# EAGLE design IntrusionNode_v2 (EAGLE 7.3.0)
DATABASE: ../../partsdb.txt
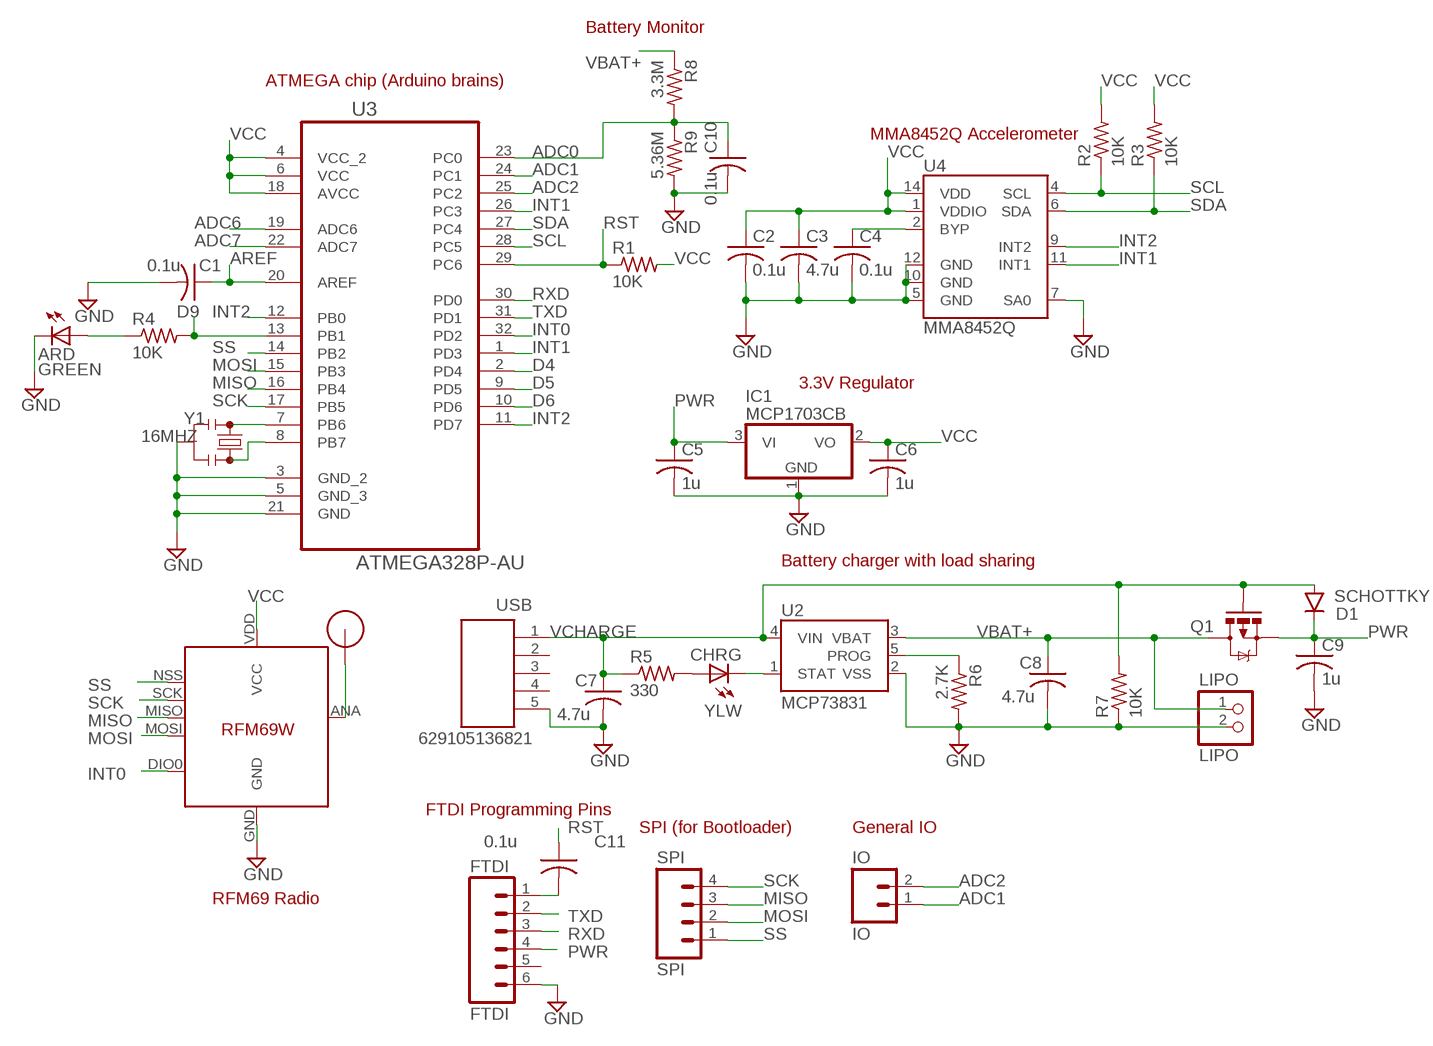
[diagram p0: schematic, sheet 1]

## Parts
ANT  RFM12B_ANTENNA  [RFM12B-ANTENNA]
ARD  GREEN  LEDCHIPLED_0805  [CHIPLED_0805]
C1  0.1u  C-USC0805  [C0805]
C2  0.1u  C-USC0805  [C0805]
C3  4.7u  C-USC0805  [C0805]
C4  0.1u  C-USC0805  [C0805]
C5  1u  C-USC0805  [C0805]
C6  1u  C-USC0805  [C0805]
C7  4.7u  C-USC0805  [C0805]
C8  4.7u  C-USC0805  [C0805]
C9  1u  C-USC0805  [C0805]
C10  0.1u  C-USC0805  [C0805]
C11  0.1u  C-USC0805  [C0805]
CHRG  YLW  LEDCHIPLED_0805  [CHIPLED_0805]
D1  SCHOTTKY  DIODESOD123  [SOD-123]
FTDI  FTDI  M06LOCK_LONGPADS  [1X06_LOCK_LONGPADS]
IC1  MCP1703CB  [SOT23]
IO  IO  M02LOCK_LONGPADS  [1X02_LOCK_LONGPADS]
LIPO  LIPO  JST_2PIN-SMT-RA  [JST-PH-2-SMT-RA]
Q1  MOSFET-PCHANNELSMD  [SOT23-3]
R1  10K  R-US_R0805  [R0805]
R2  10K  R-US_R0805  [R0805]
R3  10K  R-US_R0805  [R0805]
R4  10K  R-US_R0805  [R0805]
R5  330  R-US_R0805  [R0805]
R6  2.7K  R-US_R0805  [R0805]
R7  10K  R-US_R0805  [R0805]
R8  3.3M  R-US_R0805  [R0805]
R9  5.36M  R-US_R0805  [R0805]
SPI  SPI  M04LOCK_LONGPADS  [1X04_LOCK_LONGPADS]
U1  RFM69  [RFM69W-MINPADS]
U2  MCP73831  [SOT23-5]
U3  ATMEGA328P-AU  [QFP80P900X900X120-32N]
U4  MMA8452Q  [QFN-16_0.5MM]
USB  629105136821  [629105136821]
Y1  16MHZ  RESONATOR16MHZ  [RESONATOR-SMD]

## Nets
ADC0: C10.1 R8.2 R9.1 U3.23(PC0)
ADC1: IO.1 U3.24(PC1)
ADC2: IO.2 U3.25(PC2)
ADC6: U3.19(ADC6)
ADC7: U3.22(ADC7)
AREF: C1.1 U3.20(AREF)
D4: U3.2(PD4)
D5: U3.9(PD5)
D6: U3.10(PD6)
D9: R4.2 U3.13(PB1)
GND: ARD.C C1.2 C2.2 C3.2 C4.2 C5.2 C6.2 C7.2 C8.2 C9.2 C10.2 FTDI.6 IC1.1(GND) LIPO.2 R6.2 R7.1 R9.2 U1.GND U2.2(VSS) U3.3(GND_2) U3.5(GND_3) U3.21(GND) U4.5(GND) U4.7(SA0) U4.10(GND) U4.12(GND) USB.5 Y1.2
INT0: U1.DIO0 U3.32(PD2)
INT1: U3.1(PD3) U3.26(PC3) U4.11(INT1)
INT2: U3.11(PD7) U3.12(PB0) U4.9(INT2)
MISO: SPI.3 U1.MISO U3.16(PB4)
MOSI: SPI.2 U1.MOSI U3.15(PB3)
N$1: U3.7(PB6) Y1.1
N$2: U3.8(PB7) Y1.3
N$3: C4.1 U4.2(BYP)
N$4: ANT.P$1 U1.ANA(ANT)
N$5: ARD.A R4.1
N$6: R6.1 U2.5(PROG)
N$7: CHRG.C U2.1(STAT)
N$8: CHRG.A R5.2
N$9: C11.2 FTDI.1
PWR: C5.1 C9.1 D1.C FTDI.4 IC1.3(VI) Q1.2(S)
RST: C11.1 R1.1 U3.29(PC6)
RXD: FTDI.3 U3.30(PD0)
SCK: SPI.4 U1.SCK U3.17(PB5)
SCL: R2.1 U3.28(PC5) U4.4(SCL)
SDA: R3.1 U3.27(PC4) U4.6(SDA)
SS: SPI.1 U1.NSS(SEL) U3.14(PB2)
TXD: FTDI.2 U3.31(PD1)
VBAT+: C8.1 LIPO.1 Q1.3(D) R8.1 U2.3(VBAT)
VCC: C2.1 C3.1 C6.1 IC1.2(VO) R1.2 R2.2 R3.2 U1.VDD(VCC) U3.4(VCC_2) U3.6(VCC) U3.18(AVCC) U4.1(VDDIO) U4.14(VDD)
VCHARGE: C7.1 D1.A Q1.1(G) R5.1 R7.2 U2.4(VIN) USB.1
Unconnected: FTDI.5 USB.2 USB.3 USB.4

## Notes on the sheet
- Battery Monitor
- ATMEGA chip (Arduino brains)
- MMA8452Q Accelerometer
- 3.3V Regulator
- Battery charger with load sharing
- FTDI Programming Pins
- SPI (for Bootloader) | General IO
- RFM69 Radio

## Library data of the parts
ANT = LowPowerLab:RFM12B_ANTENNA; PARTNO: *
ARD = led:LED: LED OSRAM: - CHIPLED LG R971, LG N971, LY N971, LG Q971, LY Q971, LO R971, LY R971 LH N974, LH R974 LS Q976, LO Q976, LY Q976 LO Q996 - Hyper CHIPLED LW Q18S LB Q993, LB Q99A, LB R99A - SideLED LS A670, LO A670, LY A670, LG A670, LP A670 LB A673, LV A673, LT A673, LW A673 LH A674 LY A675 LS A676, LA A676, LO A676, LY A676, LW A676 LS A679, LY A679, LG A679 - Hyper Micro SIDELED® LS Y876, LA Y876, LO Y876, LY Y876 LT Y87S - SmartLED LW L88C, LW L88S LB L89C, LB L89S, LG L890 LS L89K, LO L89K, LY L89K LS L896, LA L896, LO L896, LY L896 - TOPLED LS T670, LO T670, LY T670, LG T670, LP T670 LSG T670, LSP T670, LSY T670, LOP T670, LYG T670 LG T671, LOG T671, LSG T671 LB T673, LV T673, LT T673, LW T673 LH T674 LS T676, LA T676, LO T676, LY T676, LB T676, LH T676, LSB T676, LW T676 LB T67C, LV T67C, LT T67C, LS T67K, LO T67K, LY T67K, LW E67C LS E67B, LA E67B, LO E67B, LY E67B, LB E67C, LV E67C, LT E67C LW T67C LS T679, LY T679, LG T679 LS T770, LO T770, LY T770, LG T770, LP T770 LB T773, LV T773, LT T773, LW T773 LH T774 LS E675, LA E675, LY E675, LS T675 LS T776, LA T776, LO T776, LY T776, LB T776 LHGB T686 LT T68C, LB T68C - Hyper Mini TOPLED® LB M676 - Mini TOPLED Santana® LG M470 LS M47K, LO M47K, LY M47K Source: http://www.osram.convergy.de LUXEON: - LUMILED® LXK2-PW12-R00, LXK2-PW12-S00, LXK2-PW14-U00, LXK2-PW14-V00 LXK2-PM12-R00, LXK2-PM12-S00, LXK2-PM14-U00 LXK2-PE12-Q00, LXK2-PE12-R00, LXK2-PE12-S00, LXK2-PE14-T00, LXK2-PE14-U00 LXK2-PB12-K00, LXK2-PB12-L00, LXK2-PB12-M00, LXK2-PB14-N00, LXK2-PB14-P00, LXK2-PB14-Q00 LXK2-PR12-L00, LXK2-PR12-M00, LXK2-PR14-Q00, LXK2-PR14-R00 LXK2-PD12-Q00, LXK2-PD12-R00, LXK2-PD12-S00 LXK2-PH12-R00, LXK2-PH12-S00 LXK2-PL12-P00, LXK2-PL12-Q00, LXK2-PL12-R00 Source: www.luxeon.com KINGBRIGHT: KA-3528ASYC Source: www.kingbright.com; PARTNO: LG R971-KN-1
C1 C2 C4 C10 C11 = rcl:C-US: CAPACITOR, American symbol; PARTNO: CL21B104KBCNNNC
C3 C7 C8 = rcl:C-US: CAPACITOR, American symbol; PARTNO: CL21A475KPFNNNE
C5 C6 C9 = rcl:C-US: CAPACITOR, American symbol; PARTNO: CL21B105KPFNNNE
CHRG = led:LED: LED OSRAM: - CHIPLED LG R971, LG N971, LY N971, LG Q971, LY Q971, LO R971, LY R971 LH N974, LH R974 LS Q976, LO Q976, LY Q976 LO Q996 - Hyper CHIPLED LW Q18S LB Q993, LB Q99A, LB R99A - SideLED LS A670, LO A670, LY A670, LG A670, LP A670 LB A673, LV A673, LT A673, LW A673 LH A674 LY A675 LS A676, LA A676, LO A676, LY A676, LW A676 LS A679, LY A679, LG A679 - Hyper Micro SIDELED® LS Y876, LA Y876, LO Y876, LY Y876 LT Y87S - SmartLED LW L88C, LW L88S LB L89C, LB L89S, LG L890 LS L89K, LO L89K, LY L89K LS L896, LA L896, LO L896, LY L896 - TOPLED LS T670, LO T670, LY T670, LG T670, LP T670 LSG T670, LSP T670, LSY T670, LOP T670, LYG T670 LG T671, LOG T671, LSG T671 LB T673, LV T673, LT T673, LW T673 LH T674 LS T676, LA T676, LO T676, LY T676, LB T676, LH T676, LSB T676, LW T676 LB T67C, LV T67C, LT T67C, LS T67K, LO T67K, LY T67K, LW E67C LS E67B, LA E67B, LO E67B, LY E67B, LB E67C, LV E67C, LT E67C LW T67C LS T679, LY T679, LG T679 LS T770, LO T770, LY T770, LG T770, LP T770 LB T773, LV T773, LT T773, LW T773 LH T774 LS E675, LA E675, LY E675, LS T675 LS T776, LA T776, LO T776, LY T776, LB T776 LHGB T686 LT T68C, LB T68C - Hyper Mini TOPLED® LB M676 - Mini TOPLED Santana® LG M470 LS M47K, LO M47K, LY M47K Source: http://www.osram.convergy.de LUXEON: - LUMILED® LXK2-PW12-R00, LXK2-PW12-S00, LXK2-PW14-U00, LXK2-PW14-V00 LXK2-PM12-R00, LXK2-PM12-S00, LXK2-PM14-U00 LXK2-PE12-Q00, LXK2-PE12-R00, LXK2-PE12-S00, LXK2-PE14-T00, LXK2-PE14-U00 LXK2-PB12-K00, LXK2-PB12-L00, LXK2-PB12-M00, LXK2-PB14-N00, LXK2-PB14-P00, LXK2-PB14-Q00 LXK2-PR12-L00, LXK2-PR12-M00, LXK2-PR14-Q00, LXK2-PR14-R00 LXK2-PD12-Q00, LXK2-PD12-R00, LXK2-PD12-S00 LXK2-PH12-R00, LXK2-PH12-S00 LXK2-PL12-P00, LXK2-PL12-Q00, LXK2-PL12-R00 Source: www.luxeon.com KINGBRIGHT: KA-3528ASYC Source: www.kingbright.com; PARTNO: LY R976-PS-36
D1 = SparkFun-DiscreteSemi:DIODE: Diode These are standard reverse protection diodes and small signal diodes. SMA package can handle up to about 1A. SOD-323 can handle about 200mA. What the SOD-323 package when ordering, there are some mfgs out there that are 5-pin packages.; PARTNO: B130LAW-7-F
FTDI = SparkFun-Connectors:M06: Header 6 Standard 6-pin 0.1" header. Use with straight break away headers (SKU : PRT-00116), right angle break away headers (PRT-00553), swiss pins (PRT-00743), machine pins (PRT-00117), and female headers (PRT-00115). Molex polarized connector foot print use with SKU : PRT-08094 with associated crimp pins and housings. NOTES ON THE VARIANTS LOCK and LOCK_LONGPADS... This footprint was designed to help hold the alignment of a through-hole component (i.e. 6-pin header) while soldering it into place. You may notice that each hole has been shifted either up or down by 0.005 of an inch from it's more standard position (which is a perfectly straight line). This slight alteration caused the pins (the squares in the middle) to touch the edges of the holes. Because they are alternating, it causes a "brace" to hold the component in place. 0.005 has proven to be the perfect amount of "off-center" position when using our standard breakaway headers. Although looks a little odd when you look at the bare footprint, once you have a header in there, the alteration is very hard to notice. Also,if you push a header all the way into place, it is covered up entirely on the bottom side. This idea of altering the position of holes to aid alignment will be further integrated into the Sparkfun Library for other footprints. It can help hold any component with 3 or more connection pins.; PARTNO: PEC36SAAN
IC1 = linear:MCP1703: 250 mA, 16V, Low Quiescent Current LDO Regulator Source: http://ww1.microchip.com/downloads/en/DeviceDoc/22049b.pdf; PARTNO: MCP1703T-3302E/CB
IO = SparkFun-Connectors:M02: Standard 2-pin 0.1" header. Use with - straight break away headers ( PRT-00116) - right angle break away headers (PRT-00553) - swiss pins (PRT-00743) - machine pins (PRT-00117) - female headers (PRT-00115) Molex polarized connector foot print use with: PRT-08233 with associated crimp pins and housings. 2.54_SCREWTERM for use with PRT-10571. 3.5mm Screw Terminal footprints for PRT-08084 5mm Screw Terminal footprints for use with PRT-08432
LIPO = adafruit:JST_2PIN: JST 2-Pin Connectors of various flavors SMT-RA (S2B-PH-SM4) 4UConnector #17311 SMT (B2B-PH-SM4) THM-RA (S2B-PH) THM (B2B-PH); PARTNO: S2B-PH-SM4-TB(LF)(SN)
Q1 = SparkFun-DiscreteSemi:MOSFET-PCHANNEL: Generic PMOSFET IRLML2244 - TRANS-11153 (SOT-23 -20V -4.3A) (1.Gate 2.Source 3.Drain) FQP27P06 - COM-10349 <http://www.sparkfun.com/products/10349> (TO-220 -60V -27A) (1.Gate 2.Source 3.Drain); PARTNO: SSM3J328R,LF
R1-R4 R7 = rcl:R-US_: RESISTOR, American symbol; PARTNO: RC2012J103CS
R5 = rcl:R-US_: RESISTOR, American symbol; PARTNO: RC2012J331CS
R6 = rcl:R-US_: RESISTOR, American symbol; PARTNO: RC2012J272CS
R8 = rcl:R-US_: RESISTOR, American symbol; PARTNO: RC2012F335CS
R9 = rcl:R-US_: RESISTOR, American symbol; PARTNO: RC2012F5364CS
SPI = SparkFun-Connectors:M04: Header 4 Standard 4-pin 0.1" header. Use with straight break away headers (SKU : PRT-00116), right angle break away headers (PRT-00553), swiss pins (PRT-00743), machine pins (PRT-00117), and female headers (PRT-00115). Molex polarized connector foot print use with SKU : PRT-08231 with associated crimp pins and housings. 1MM SMD Version SKU: PRT-10208; PARTNO: PEC36SAAN
U1 = LowPowerLab:RFM69; PARTNO: RFM69W
U2 = SparkFun-PowerIC:MCP73831: Miniature single cell, fully integrated Li-Ion, Li-polymer charge management controller http://ww1.microchip.com/downloads/en/DeviceDoc/20001984g.pdf IC-09995; PARTNO: MCP73831T-2ATI/OT; PROD_ID: IC-09995
U3 = MTRTech:ATMEGA328P-AU: 8-bit Microcontroller with In-System Programmable Flash; MPN: ATMEGA328P-AU; OC_FARNELL: 1715486; OC_NEWARK: 14R4631; PACKAGE: TQFP-32; PARTNO: ATMEGA328P-AUR; SUPPLIER: Atmel
U4 = SparkFun-Sensors:MMA8452Q: MMA8452Q 3-Axis, 12/8-bit Digital Accelerometer Supply Voltage: 1.6-3.6V Range: +/- 2g, 4g, 8g Interface: I2C, 12-bit and 8-bit ODR: 1.56 Hz - 800 Hz Package: QFN-16 http://cache.freescale.com/files/sensors/doc/data_sheet/MMA8452Q.pdf; PARTNO: MMA8452QT; PROD_ID: IC-10769
USB = Wurth_Elektronik_Electromechanic_Input-Output_Connectors_rev15c:629105136821: WR-COM SMT Horizontal 5 Contacts Micro USB Type B,5 pins=>Code : Con_I-O_COM_MicroUSB_629105136821 <http://katalog.we-online.de/media/images/eican/Con_I-O_COM_MicroUSB_629105136821_pf2.jpg> Details see: http://katalog.we-online.de/en/em/629_105_136_821 Created 2014-07-09, Karrer Zheng 2014 (C) Würth Elektronik; PARTNO: 629105136821
Y1 = SparkFun-FreqCtrl:RESONATOR: Resonator Small SMD resonator. Used, eg, on the Arduino Pro/ Pro Mini boards. 8MHz- XTAL-08895 16MHz- XTAL-08900; PARTNO: CSTCE16M0V53-R0; PROD_ID: XTAL-08900

## Net classes
1 power: width 0.381 mm, clearance 0.254 mm

## Board
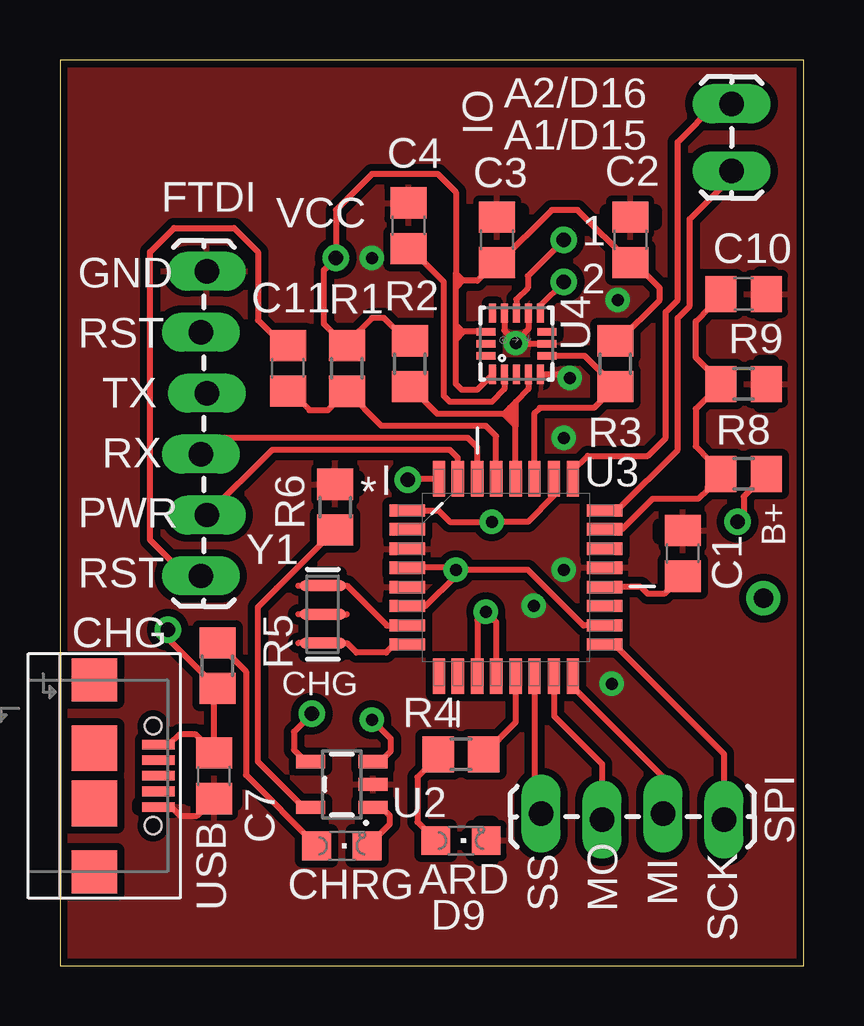
[diagram p1: board, top side]
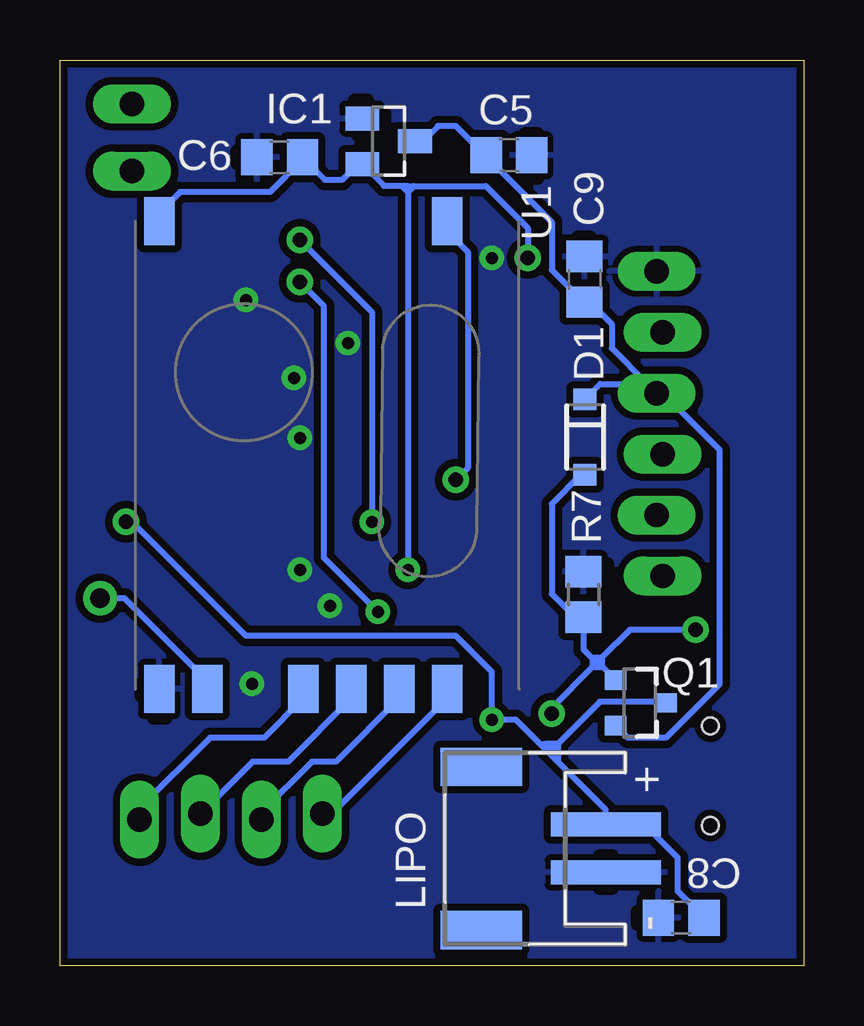
[diagram p2: board, bottom side, seen from below]

Size 31 x 37.75 mm. Coordinates in mm from the lower left corner, seen from the top.
Outline: 0,37.75 0,0 31,0 31,37.75 0,37.75
Copper layers (1*16): Top 0.035mm / dielectric 1.5mm / Bottom 0.035mm
Design rules "SparkFun-2-layer": minimum track width 7mil, minimum drill 15mil, track to track 8mil, track to pad 8mil, pad to pad 8mil, via to via 8mil, smd to smd 8mil, copper to edge 8mil, drill to drill 8mil, minimum pad ring 12mil, minimum via ring 10mil, stop-mask expansion 4mil, vias tented up to drill 20mil, thermal gap 10mil
tRestrict: area 29.2,28.8 to 29.7,28.9; area 29.2,27.1 to 29.7,27.2; area 29.2,25.1 to 29.7,25.1; area 29.2,23.4 to 29.7,23.4; area 25,17.9 to 25.2,18.4; area 17.5,5.8 to 18,6; area 17.5,4.5 to 18,4.5; area 7.2,6.8 to 7.3,7.2; area 12.3,19.9 to 12.4,20.4; area 15.3,31.5 to 15.4,32; area 19,31 to 19.2,31.5; area 22.8,31 to 23,31.5; 5 more areas
bRestrict: area 6.7,1.8 to 6.9,2.2; area 27.5,11.2 to 27.6,11.8; area 23.5,33.5 to 23.6,34; area 18.2,35.9 to 18.7,36; area 17.5,35 to 17.7,35.5; area 11.1,32.9 to 11.6,33; area 11.1,34.5 to 11.6,34.6; area 8.9,30.2 to 9.4,30.4; area 8.2,16.1 to 8.4,16.8; area 8,4.5 to 8.5,4.5; area 8,3.2 to 8.5,3.3; area 18.2,34.7 to 18.6,34.8; 1 more areas

### Footprints (pad centres in the part's own frame; a part is rotated, then mirrored left to right if it is on the bottom)
RFM12B-ANTENNA = drill 0.8 pad 1.422: P$1 0,0
CHIPLED_0805 = smd 1.2 x 1.2: A 0,-1.05; C 0,1.05
C0805 = smd 1.3 x 1.5: 1 -0.95,0; 2 0.95,0
SOD-123 = smd 0.9 x 0.95: A 1.575,0; C -1.575,0
1X06_LOCK_LONGPADS = drill 1.016 long: 1 0,0; 2 2.54,-0.254; 3 5.08,0; 4 7.62,-0.254; 5 10.16,0; 6 12.7,-0.254
SOT23 = smd 1 x 1.4: 1 -0.95,-1.1; 2 0.95,-1.1; 3 0,1.1
1X02_LOCK_LONGPADS = drill 1.016 long: 1 -0.127,0; 2 2.667,0
JST-PH-2-SMT-RA = smd 1 x 4.6: 1 1,-3.7; 2 -1,-3.7 | smd 1.6 x 3.4: NC1 -3.4,1.5; NC2 3.4,1.5
SOT23-3 = smd 0.8 x 0.9: 1 -0.95,-1; 2 0.95,-1; 3 0,1.1
R0805 = smd 1.3 x 1.5: 1 -0.95,0; 2 0.95,0
1X04_LOCK_LONGPADS = drill 1.016 long: 1 0,0; 2 2.54,-0.254; 3 5.08,0; 4 7.62,-0.254
RFM69W-MINPADS = smd 2 x 1.27: ANA 8,-5; DIO0 -11.5,5; GND 8,-7; MISO 8,1; MOSI 8,3; NSS 8,5; SCK 8,-1; VDD -11.5,-7
SOT23-5 = smd 0.55 x 1.2: 1 -0.95,-1.3; 2 0,-1.3; 3 0.95,-1.3; 4 0.95,1.3; 5 -0.95,1.3
QFP80P900X900X120-32N = smd 1.473 x 0.508: 1 -4.115,2.794; 2 -4.115,2.007; 3 -4.115,1.194; 4 -4.115,0.406; 5 -4.115,-0.406; 6 -4.115,-1.194; 7 -4.115,-2.007; 8 -4.115,-2.794; 17 4.115,-2.794; 18 4.115,-2.007; 19 4.115,-1.194; 20 4.115,-0.406; 21 4.115,0.406; 22 4.115,1.194; 23 4.115,2.007; 24 4.115,2.794 | smd 0.508 x 1.473: 9 -2.794,-4.115; 10 -2.007,-4.115; 11 -1.194,-4.115; 12 -0.406,-4.115; 13 0.406,-4.115; 14 1.194,-4.115; 15 2.007,-4.115; 16 2.794,-4.115; 25 2.794,4.115; 26 2.007,4.115; 27 1.194,4.115; 28 0.406,4.115; 29 -0.406,4.115; 30 -1.194,4.115; 31 -2.007,4.115; 32 -2.794,4.115
QFN-16_0.5MM = smd 0.8 x 0.3: 1 -1.275,1; 2 -1.275,0.5; 3 -1.275,0; 4 -1.275,-0.5; 5 -1.275,-1; 9 1.275,-1; 10 1.275,-0.5; 11 1.275,0; 12 1.275,0.5; 13 1.275,1 | smd 0.3 x 0.8: 6 -0.5,-1.275; 7 0,-1.275; 8 0.5,-1.275; 14 0.5,1.275; 15 0,1.275; 16 -0.5,1.275
629105136821 = smd 0.4 x 1.35: 1 -1.3,0; 2 -0.65,0; 3 0,0; 4 0.65,0; 5 1.3,0 | smd 1.8 x 1.9: Z1 -4,-2.675; Z4 4,-2.675 | smd 1.9 x 1.9: Z2 -1.15,-2.675; Z3 1.15,-2.675 | hole 0.7: -2.075,-0.225; 2.075,-0.225
RESONATOR-SMD = smd 0.45 x 1.905: 1 -1.2,0; 2 0,0; 3 1.2,0

### Placement (x,y rotation side)
ANT  29.33,15.31 0 top
ARD  16.72,5.21 270 top
C1  25.96,17.18 90 top
C2  23.78,30.25 90 top
C3  18.22,30.25 90 top
C4  14.53,30.84 90 top
C5  12.28,33.78 0 bottom
C6  21.84,33.69 180 bottom
C7  6.42,7.91 270 top
C8  5.1,2 180 bottom
C9  9.13,28.61 90 bottom
C10  28.5,28 0 top
C11  9.5,24.9 90 top
CHRG  11.75,4.99 270 top
D1  9.11,22.03 270 bottom
FTDI  5.87,16.24 90 top
IC1  17.3,34.36 270 bottom
IO  28,33.25 90 top
LIPO  11.94,4.88 90 bottom
Q1  6.83,10.95 270 bottom
R1  11.96,24.89 90 top
R2  14.59,25.09 90 top
R3  23.15,25.09 90 top
R4  16.72,8.81 0 top
R5  6.57,12.5 90 top
R6  11.47,19.11 90 top
R7  9.17,15.47 270 bottom
R8  28.5,20.5 180 top
R9  28.5,24.25 0 top
SPI  20.06,6.33 0 top
U1  19.86,19.53 270 bottom
U2  11.75,7.55 90 top
U3  18.59,16.18 0 top
U4  19.03,25.92 90 top
USB  4.11,7.91 270 top
Y1  10.95,14.64 270 top

### Tracks (layer width: path | path; a pad name or v marks a point on that pad's centre or on a via)
ADC0
  Top 0.254: R8.2 27.5,20.5 | C10.1 27.1,27.55 27.1,27.45 26.5,26.85 26.5,25.35 27.55,24.3 R9.1 26.5,23.2 26.5,21.65 27.1,21.05 27.1,20.95 R8.2 | U3.23 23.44,18.19 24.7,19.45 26.6,19.45 27,19.85 27,19.95 R8.2
ADC1
  Top 0.254: U3.24 23.22,18.97 25.75,21.5 25.75,27 26.25,27.5 26.25,31.12 28,32.87 IO.1
ADC2
  Top 0.254: U3.25 21.38,20.63 22,21.25 24.5,21.25 25.25,22 25.25,27.25 25.75,27.75 25.75,34.33 27.33,35.92 IO.2
AREF
  Top 0.254: C1.1 25.94,16.25 25.19,15.5 24.5,15.5 24.23,15.77 U3.20
D9
  Top 0.254: U3.13 19,10.14 R4.2
GND  (via drill 0.5)
  Top 0.254: U4.12 18.53,26.47 18.88,26.12 | 18.88,26.12 19.08,25.92 U4.7 | U4.10 19.53,26.53 19.25,26.25 | 19.25,26.25 19.12,26.12 18.88,26.12 | 19.25,26 19.25,26.25 | v21.25,24.5 21.11,24.64 U4.5 | 6.07,6.61 5.96,6.61 | USB.5 4.17,6.55 4.7,6.55 5,6.25 5.71,6.25 C7.2
  Top 0.406: 6.07,6.61 C7.2
  other vias: 19.75,15 13,29.5 23.25,27.75 21,22 23,11.75 19,25.95 21,16.5
  pour Bottom (isolate 0.305): -1.5,38.75 -1.5,-1.5 32.5,-1.5 32.5,38.75
  pour Top (isolate 0.305): -2.25,40 -2.25,-1.25 32.5,-1.25 32.5,40
INT0  (via drill 0.6)
  Top 0.254: v14.5,20.25 14.54,20.3 U3.32
  Bottom 0.254: U1.DIO0 14.86,30.61 14,29.75 14,20.75 v14.5,20.25
INT1  (via drill 0.5, 0.6)
  Top 0.254: v21,30.25 19.5,28.75 19.5,28.25 19.03,27.78 U4.11 | U3.1 15.78,18.97 16.25,18.5 v18,18.5 19.5,18.5 20.6,19.6 U3.26
  Bottom 0.254: v21,30.25 18,27.25 v18,18.5
INT2  (via drill 0.5, 0.6)
  Top 0.254: v21,28.5 20.03,27.53 U4.9 | U3.11 17.4,14.4 v17.75,14.75 18.18,14.32 U3.12
  Bottom 0.254: v17.75,14.75 20,17 20,27.5 v21,28.5
MISO
  Top 0.254: U3.16 21.38,11.62 25.14,7.86 SPI.3
  Bottom 0.254: U1.MISO 18.86,11.14 21.5,8.5 22.97,8.5 SPI.3
MOSI
  Top 0.254: U3.15 20.6,10.4 22.6,8.4 SPI.2
  Bottom 0.254: U1.MOSI 16.86,11.14 19.5,8.5 20.5,8.5 22.6,6.4 SPI.2
N$1
  Top 0.254: 11.97,15.84 13.63,14.17 U3.7
N$2
  Top 0.254: U3.8 13.94,13.39 13.6,13.05 12.36,13.05 11.97,13.44
N$3
  Top 0.254: U4.2 18.53,24.03 18,23.5 16.25,23.5 16,23.75 16,28.5 14.61,29.89 C4.1
N$4
  Bottom 0.254: ANT.P$1 28.31,15.31 24.86,11.86 U1.ANA
N$5
  Top 0.254: 15.77,5.31 ARD.A 14.9,5.98 14.9,7.85 15.77,8.72 R4.1
N$6
  Top 0.254: R6.1 9.03,15.72 8.5,15.19 8.25,14.94 8.25,8.5 10.15,6.6 U2.5
N$7
  Top 0.254: CHRG.C 12.84,4.99 13.75,5.9 13.75,6.25 13.4,6.6 U2.1
N$8
  Top 0.254: R5.2 7.75,12.27 7.75,7.94 CHRG.A
N$9
  Top 0.254: FTDI.1 5.26,16.24 3.75,17.75 3.75,29.75 4.75,30.75 7.25,30.75 8.25,29.75 8.25,26.9 9,26.15 9.2,26.15 C11.2
PWR
  Bottom 0.254: 6.51,24.24 8,25.74 8,26.75 8.91,27.66 C9.1 9.16,27.66 10.5,29 10.5,31 13.23,33.73 C5.1 13.28,33.78 14.5,35 15.25,35 15.89,34.36 IC1.3 | 6.51,24.24 FTDI.4 5.86,23.86 3.5,21.5 3.5,11.75 5.75,9.5 7.33,9.5 Q1.2 | D1.C 8.47,24.24 6.51,24.24
RST
  Top 0.254: U3.29 18.18,22.07 17.75,22.5 13.4,22.5 R1.1 11.17,23.15 10.4,23.15 9.6,23.95 C11.1
RXD
  Top 0.254: U3.30 17.4,21.6 17,22 6.55,22 FTDI.3
SCK
  Top 0.254: U3.17 23.11,13.39 27.68,8.82 SPI.4
  Bottom 0.254: SPI.4 27.68,6.57 24.75,9.5 22.5,9.5 20.86,11.14 U1.SCK
SCL
  Top 0.254: U4.4 19.53,24.03 19,23.5 | 19,23.5 18.75,23.25 | 18.75,23.25 18.5,23 | 18.5,23 15.73,23 R2.1 | U3.28 19,22.5 18.75,22.75 | 18.75,22.75 18.5,23 | 18.75,22.75 18.75,23.25 | 19,22.5 19,23.5
SDA
  Top 0.254: U3.27 19.78,23.03 20,23.25 22.26,23.25 R3.1 21.87,25.42 U4.6
SS
  Top 0.254: U3.14 19.78,6.61 SPI.1
  Bottom 0.254: U1.NSS 14.86,11.14 19.67,6.33 SPI.1
TXD
  Top 0.254: U3.31 16.58,21.17 16.25,21.5 8.84,21.5 FTDI.2
VBAT+  (via drill 0.5, 0.6)
  Top 0.254: 28.5,18.5 v28.25,18.5 28.5,18.75 28.5,19.55 R8.1 | U2.3 13.35,8.5 13.8,8.95 13.8,9.45 v13,10.25
  Bottom 0.254: 10.25,8.5 8.24,6.49 LIPO.1 6.63,5.88 5.25,4.5 5.25,3.1 C8.1 | 10.25,8.5 10.62,8.88 | 10.62,8.88 11,9.25 | Q1.3 5.78,11 8.5,11 10.25,9.25 | 10.25,9.25 10.62,8.88 | 10.25,9.25 10.25,8.75 | 10.25,8.75 10.25,8.5 | 10.25,9.25 10.75,9.25 | 11,9.25 10.75,9.25 | 10.75,9.25 10.25,8.75 | v28.25,18.5 28,18.5 23.25,13.75 14.5,13.75 13,12.25 v13,10.25 12,10.25 11,9.25
VCC  (via drill 0.5, 0.6)
  Top 0.254: U4.1 17.39,24 16.75,24 16.5,24.25 16.5,26.1 | 16.5,26.1 16.5,26.42 | 16.5,26.42 16.5,26.7 | U4.14 16.5,26.42 | 16.5,26.7 16.8,26.4 16.5,26.1 | 23.03,26.04 R3.2 23.29,26.04 25,27.75 25,28.25 23.95,29.3 C2.1 21.58,31.5 20.5,31.5 18.3,29.3 C3.1 18.22,29.22 18.19,29.25 18.1,29.25 17.4,28.55 16.8,28.55 | 14.56,16.5 U3.4 16.41,16.59 | 14.46,26.04 R2.2 14.13,26.5 14,26.5 13.5,27 13,27 11.96,25.96 R1.2 11.55,26.25 11.5,26.25 11,26.75 11,29 v11.5,29.5 11.5,31.5 13,33 15.75,33 16.5,32.25 16.5,28.85 | 16.5,26.7 16.5,28.25 | 16.5,28.25 16.5,28.5 | 16.5,28.5 16.5,28.85 | U3.6 15.24,14.99 16.5,16.25 v16.5,16.5 | 16.41,16.59 v16.5,16.5 | v16.5,16.5 19.5,16.5 21.83,14.17 U3.18 | 16.41,16.59 16.5,16.67 | 16.8,28.55 16.55,28.55 16.5,28.5 | 16.8,28.55 16.5,28.85 | 16.8,28.55 16.5,28.25
  Bottom 0.254: U1.VDD 26.5,31.39 26.5,31.75 26,32.25 22.25,32.25 20.89,33.61 C6.1 19.95,32.75 19.25,32.75 18.5,33.5 18.49,33.5 IC1.2 17.5,32.51 17.5,32.5 16.75,32.5 | 16.5,32.5 16.5,32.25 | 16.5,32.25 v16.5,16.5 | 16.5,32.5 16.75,32.5 | 16.5,32.5 16.25,32.5 | 16.25,32.5 16.5,32.25 | 16.5,32.25 16.75,32.5 | 16.25,32.5 13.25,32.5 11.5,30.75 v11.5,29.5
VCHARGE  (via drill 0.6)
  Top 0.254: C7.1 6.42,11.4 | v4.5,14 4.5,13.62 R5.1 | USB.1 4.56,9.21 5,9.65 5.63,9.65 6.07,9.21 | U2.4 10.25,8.5 9.75,9 9.75,9.75 v10.5,10.5
  Top 0.406: 6.07,9.21 C7.1 | 6.42,11.4 R5.1
  Bottom 0.254: 8.62,12.62 8.55,12.62 Q1.1 | v4.5,14 7.25,14 8.4,12.85 | 8.4,12.85 8.62,12.62 | 8.62,12.62 8.8,12.45 | 8.8,12.45 8.4,12.45 8.4,12.85 | 8.85,12.85 9.17,13.17 R7.2 9.4,14.75 9.75,14.75 10.5,15.5 10.5,19.25 9.29,20.45 D1.A | 8.8,12.8 8.62,12.62 | 8.85,12.85 8.8,12.8 | 8.8,12.8 8.8,12.45 | 8.85,12.85 8.4,12.85 | v10.5,10.5 10.5,10.75 8.8,12.45

### Text on the board
tPlace: A2/D16 | A1/D15 | VCC | 1 | GND | 2 | RST | TX | RX | I | PWR | B+ | RST | CHG | CHG | D9 | SS | MO | MI | SCK